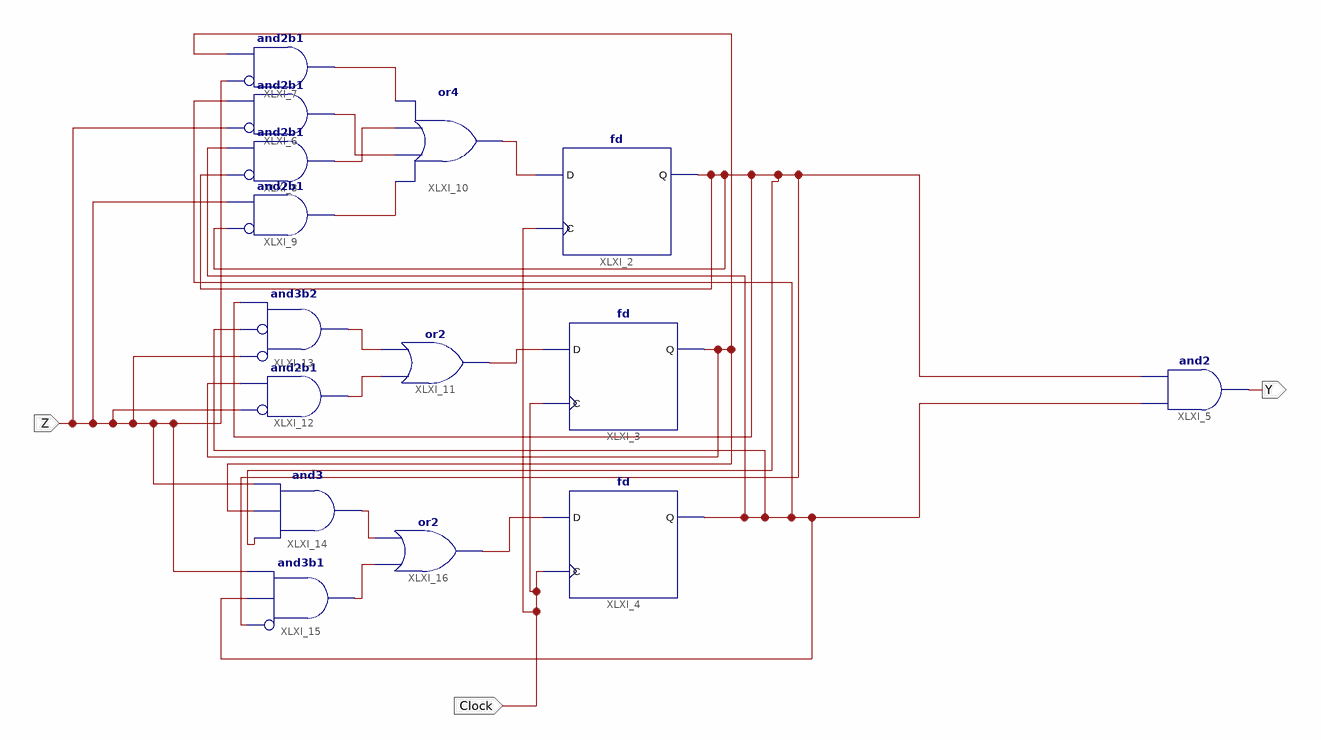
[diagram p0: schematic sheet 1]
// Xilinx ISE schematic detektorSchemat.sch (artix7) as structural Verilog: 15 symbols, 3 ports
module detektorSchemat (
  input  Z,
  input  Clock,
  output Y
);

  wire XLXN_4, XLXN_5, XLXN_6, XLXN_7, XLXN_8, XLXN_19, XLXN_21, XLXN_23, XLXN_27, XLXN_28, XLXN_29, XLXN_30,
       XLXN_36, XLXN_37;

  fd XLXI_2 (.C(Clock), .D(XLXN_8), .Q(XLXN_37));
  fd XLXI_3 (.C(Clock), .D(XLXN_21), .Q(XLXN_23));
  fd XLXI_4 (.C(Clock), .D(XLXN_29), .Q(XLXN_36));
  and XLXI_5 (Y, XLXN_36, XLXN_37);
  and XLXI_6 (XLXN_6, ~Z, XLXN_36);  // and2b1
  and XLXI_7 (XLXN_7, ~Z, XLXN_23);  // and2b1
  and XLXI_8 (XLXN_5, ~XLXN_37, XLXN_36);  // and2b1
  and XLXI_9 (XLXN_4, ~XLXN_37, Z);  // and2b1
  or XLXI_10 (XLXN_8, XLXN_4, XLXN_6, XLXN_5, XLXN_7);
  or XLXI_11 (XLXN_21, XLXN_30, XLXN_19);
  and XLXI_12 (XLXN_30, ~Z, XLXN_23);  // and2b1
  and XLXI_13 (XLXN_19, ~Z, ~XLXN_36, XLXN_37);  // and3b2
  and XLXI_14 (XLXN_27, XLXN_37, XLXN_23, Z);
  and XLXI_15 (XLXN_28, ~XLXN_37, XLXN_36, Z);  // and3b1
  or XLXI_16 (XLXN_29, XLXN_28, XLXN_27);
endmodule
